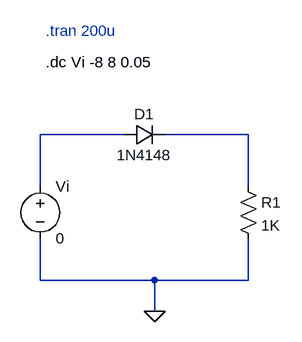
[diagram p0: schematic 112.asc]
112.asc, the LTspice schematic file:
Version 4.1
SHEET 1 880 680
WIRE 192 96 64 96
WIRE 384 96 256 96
WIRE 64 176 64 96
WIRE 384 176 384 96
WIRE 64 320 64 256
WIRE 240 320 64 320
WIRE 384 320 384 256
WIRE 384 320 240 320
WIRE 240 368 240 320
FLAG 240 368 0
SYMBOL diode 192 80 M90
WINDOW 0 0 32 VBottom 2
WINDOW 3 32 32 VTop 2
SYMATTR InstName D1
SYMATTR Value 1N4148
SYMBOL res 368 160 R0
SYMATTR InstName R1
SYMATTR Value 1K
SYMBOL voltage 64 160 R0
WINDOW 123 0 0 Left 0
WINDOW 39 0 0 Left 0
SYMATTR InstName Vi
SYMATTR Value 0
TEXT 72 -64 Left 2 ;.tran 200u
TEXT 72 -16 Left 2 !.dc Vi -8 8 0.05

The netlist it stands for:
* 112.asc
D1 N001 N002 1N4148
R1 N002 0 1K
Vi N001 0 0
.model D D
.lib standard.dio
* .tran 200u
.dc Vi -8 8 0.05
.backanno
.end

* Results of the author's LTspice run, read from the files saved beside the schematic
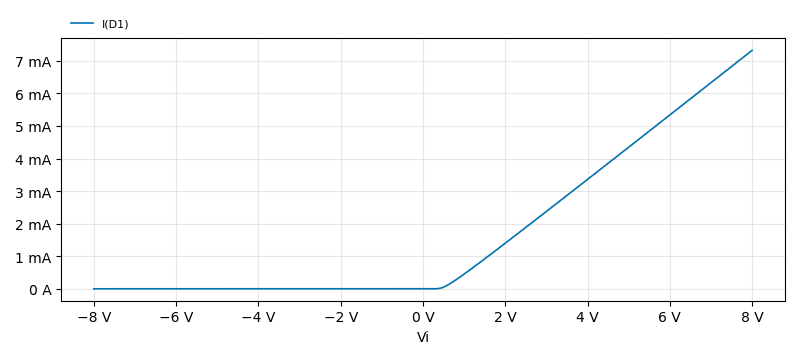
[diagram p1: DC transfer characteristic of 112.asc, plotted from the saved traces]
* DC transfer characteristic, 1 run:
*   I(D1): -2.528 nA at Vi=-8 V, 7.321 mA at Vi=8 V, min -2.528 nA, max 7.321 mA